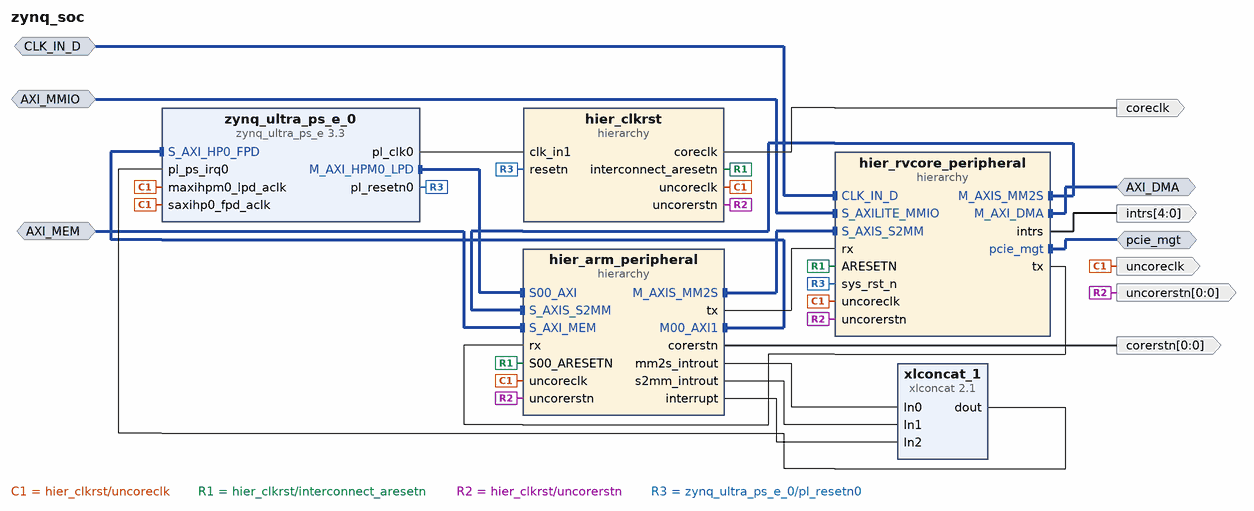
[diagram p0: block diagram of the top level]
# Vivado block design zynq_soc, xczu19eg-ffvc1760-2-i, Vivado 2020.2
create_bd_design zynq_soc

create_bd_intf_port -mode Master -vlnv xilinx.com:interface:aximm_rtl:1.0 AXI_DMA
set_property -dict [list \
  CONFIG.ADDR_WIDTH 40 \
  CONFIG.DATA_WIDTH 64 \
  CONFIG.NUM_READ_OUTSTANDING 2 \
  CONFIG.NUM_WRITE_OUTSTANDING 2 \
  CONFIG.PROTOCOL AXI4 \
] [get_bd_intf_ports AXI_DMA]
create_bd_intf_port -mode Slave -vlnv xilinx.com:interface:aximm_rtl:1.0 AXI_MEM
set_property -dict [list \
  CONFIG.ADDR_WIDTH 40 \
  CONFIG.ARUSER_WIDTH 1 \
  CONFIG.AWUSER_WIDTH 1 \
  CONFIG.BUSER_WIDTH 0 \
  CONFIG.DATA_WIDTH 64 \
  CONFIG.HAS_BRESP 1 \
  CONFIG.HAS_BURST 1 \
  CONFIG.HAS_CACHE 1 \
  CONFIG.HAS_LOCK 1 \
  CONFIG.HAS_PROT 1 \
  CONFIG.HAS_QOS 1 \
  CONFIG.HAS_REGION 0 \
  CONFIG.HAS_RRESP 1 \
  CONFIG.HAS_WSTRB 1 \
  CONFIG.ID_WIDTH 4 \
  CONFIG.MAX_BURST_LENGTH 256 \
  CONFIG.NUM_READ_OUTSTANDING 16 \
  CONFIG.NUM_READ_THREADS 1 \
  CONFIG.NUM_WRITE_OUTSTANDING 16 \
  CONFIG.NUM_WRITE_THREADS 1 \
  CONFIG.PROTOCOL AXI4 \
  CONFIG.READ_WRITE_MODE READ_WRITE \
  CONFIG.RUSER_BITS_PER_BYTE 0 \
  CONFIG.RUSER_WIDTH 0 \
  CONFIG.SUPPORTS_NARROW_BURST 1 \
  CONFIG.WUSER_BITS_PER_BYTE 0 \
  CONFIG.WUSER_WIDTH 0 \
] [get_bd_intf_ports AXI_MEM]
create_bd_intf_port -mode Slave -vlnv xilinx.com:interface:aximm_rtl:1.0 AXI_MMIO
set_property -dict [list \
  CONFIG.ADDR_WIDTH 40 \
  CONFIG.ARUSER_WIDTH 0 \
  CONFIG.AWUSER_WIDTH 0 \
  CONFIG.BUSER_WIDTH 0 \
  CONFIG.DATA_WIDTH 64 \
  CONFIG.HAS_BRESP 1 \
  CONFIG.HAS_BURST 0 \
  CONFIG.HAS_CACHE 0 \
  CONFIG.HAS_LOCK 0 \
  CONFIG.HAS_PROT 1 \
  CONFIG.HAS_QOS 0 \
  CONFIG.HAS_REGION 0 \
  CONFIG.HAS_RRESP 1 \
  CONFIG.HAS_WSTRB 1 \
  CONFIG.ID_WIDTH 8 \
  CONFIG.MAX_BURST_LENGTH 1 \
  CONFIG.NUM_READ_OUTSTANDING 2 \
  CONFIG.NUM_READ_THREADS 1 \
  CONFIG.NUM_WRITE_OUTSTANDING 2 \
  CONFIG.NUM_WRITE_THREADS 1 \
  CONFIG.PROTOCOL AXI4 \
  CONFIG.READ_WRITE_MODE READ_WRITE \
  CONFIG.RUSER_BITS_PER_BYTE 0 \
  CONFIG.RUSER_WIDTH 0 \
  CONFIG.SUPPORTS_NARROW_BURST 0 \
  CONFIG.WUSER_BITS_PER_BYTE 0 \
  CONFIG.WUSER_WIDTH 0 \
] [get_bd_intf_ports AXI_MMIO]
create_bd_intf_port -mode Slave -vlnv xilinx.com:interface:diff_clock_rtl:1.0 CLK_IN_D
create_bd_intf_port -mode Master -vlnv xilinx.com:interface:pcie_7x_mgt_rtl:1.0 pcie_mgt
create_bd_port -dir O -type clk coreclk
create_bd_port -dir O -from 0 -to 0 corerstn
create_bd_port -dir O -from 4 -to 0 intrs
create_bd_port -dir O -type clk uncoreclk
set_property -dict {CONFIG.ASSOCIATED_BUSIF AXI_MEM:AXI_MMIO:AXI_DMA} [get_bd_ports uncoreclk]
create_bd_port -dir O -from 0 -to 0 -type rst uncorerstn

create_bd_cell -type hier hier_clkrst
create_bd_cell -type hier hier_rvcore_peripheral
create_bd_cell -type hier hier_arm_peripheral
create_bd_cell -type ip -vlnv xilinx.com:ip:xlconcat:2.1 xlconcat_1
set_property -dict {CONFIG.NUM_PORTS 3} [get_bd_cells xlconcat_1]
create_bd_cell -type ip -vlnv xilinx.com:ip:zynq_ultra_ps_e:3.3 zynq_ultra_ps_e_0
set_property -dict [list \
  CONFIG.CAN0_BOARD_INTERFACE custom \
  CONFIG.CAN1_BOARD_INTERFACE custom \
  CONFIG.CSU_BOARD_INTERFACE custom \
  CONFIG.DP_BOARD_INTERFACE custom \
  CONFIG.GEM0_BOARD_INTERFACE custom \
  CONFIG.GEM1_BOARD_INTERFACE custom \
  CONFIG.GEM2_BOARD_INTERFACE custom \
  CONFIG.GEM3_BOARD_INTERFACE custom \
  CONFIG.GPIO_BOARD_INTERFACE custom \
  CONFIG.IIC0_BOARD_INTERFACE custom \
  CONFIG.IIC1_BOARD_INTERFACE custom \
  CONFIG.NAND_BOARD_INTERFACE custom \
  CONFIG.PCIE_BOARD_INTERFACE custom \
  CONFIG.PJTAG_BOARD_INTERFACE custom \
  CONFIG.PMU_BOARD_INTERFACE custom \
  CONFIG.PSU_BANK_0_IO_STANDARD LVCMOS33 \
  CONFIG.PSU_BANK_1_IO_STANDARD LVCMOS33 \
  CONFIG.PSU_BANK_2_IO_STANDARD LVCMOS33 \
  CONFIG.PSU_BANK_3_IO_STANDARD LVCMOS33 \
  CONFIG.PSU_USB3__DUAL_CLOCK_ENABLE 1 \
  CONFIG.PSU__CAN1__PERIPHERAL__ENABLE 0 \
  CONFIG.PSU__CRF_APB__ACPU_CTRL__FREQMHZ 1200 \
  CONFIG.PSU__CRF_APB__ACPU_CTRL__SRCSEL APLL \
  CONFIG.PSU__CRF_APB__APLL_CTRL__SRCSEL PSS_REF_CLK \
  CONFIG.PSU__CRF_APB__DBG_FPD_CTRL__FREQMHZ 250 \
  CONFIG.PSU__CRF_APB__DBG_FPD_CTRL__SRCSEL IOPLL \
  CONFIG.PSU__CRF_APB__DBG_TRACE_CTRL__FREQMHZ 250 \
  CONFIG.PSU__CRF_APB__DBG_TRACE_CTRL__SRCSEL IOPLL \
  CONFIG.PSU__CRF_APB__DBG_TSTMP_CTRL__FREQMHZ 250 \
  CONFIG.PSU__CRF_APB__DBG_TSTMP_CTRL__SRCSEL IOPLL \
  CONFIG.PSU__CRF_APB__DDR_CTRL__FREQMHZ 1067 \
  CONFIG.PSU__CRF_APB__DDR_CTRL__SRCSEL DPLL \
  CONFIG.PSU__CRF_APB__DPDMA_REF_CTRL__FREQMHZ 600 \
  CONFIG.PSU__CRF_APB__DPDMA_REF_CTRL__SRCSEL APLL \
  CONFIG.PSU__CRF_APB__DPLL_CTRL__SRCSEL PSS_REF_CLK \
  CONFIG.PSU__CRF_APB__DP_AUDIO_REF_CTRL__SRCSEL RPLL \
  CONFIG.PSU__CRF_APB__DP_STC_REF_CTRL__SRCSEL RPLL \
  CONFIG.PSU__CRF_APB__DP_VIDEO_REF_CTRL__SRCSEL VPLL \
  CONFIG.PSU__CRF_APB__GDMA_REF_CTRL__FREQMHZ 600 \
  CONFIG.PSU__CRF_APB__GDMA_REF_CTRL__SRCSEL APLL \
  CONFIG.PSU__CRF_APB__GPU_REF_CTRL__FREQMHZ 500 \
  CONFIG.PSU__CRF_APB__GPU_REF_CTRL__SRCSEL IOPLL \
  CONFIG.PSU__CRF_APB__TOPSW_LSBUS_CTRL__FREQMHZ 100 \
  CONFIG.PSU__CRF_APB__TOPSW_LSBUS_CTRL__SRCSEL IOPLL \
  CONFIG.PSU__CRF_APB__TOPSW_MAIN_CTRL__FREQMHZ 533.33 \
  CONFIG.PSU__CRF_APB__TOPSW_MAIN_CTRL__SRCSEL DPLL \
  CONFIG.PSU__CRF_APB__VPLL_CTRL__SRCSEL PSS_REF_CLK \
  CONFIG.PSU__CRL_APB__ADMA_REF_CTRL__FREQMHZ 500 \
  CONFIG.PSU__CRL_APB__ADMA_REF_CTRL__SRCSEL IOPLL \
  CONFIG.PSU__CRL_APB__CAN1_REF_CTRL__FREQMHZ 100 \
  CONFIG.PSU__CRL_APB__CAN1_REF_CTRL__SRCSEL IOPLL \
  CONFIG.PSU__CRL_APB__CPU_R5_CTRL__FREQMHZ 500 \
  CONFIG.PSU__CRL_APB__CPU_R5_CTRL__SRCSEL IOPLL \
  CONFIG.PSU__CRL_APB__DBG_LPD_CTRL__FREQMHZ 250 \
  CONFIG.PSU__CRL_APB__DBG_LPD_CTRL__SRCSEL IOPLL \
  CONFIG.PSU__CRL_APB__GEM3_REF_CTRL__FREQMHZ 125 \
  CONFIG.PSU__CRL_APB__GEM3_REF_CTRL__SRCSEL IOPLL \
  CONFIG.PSU__CRL_APB__I2C0_REF_CTRL__FREQMHZ 100 \
  CONFIG.PSU__CRL_APB__I2C0_REF_CTRL__SRCSEL IOPLL \
  CONFIG.PSU__CRL_APB__I2C1_REF_CTRL__FREQMHZ 100 \
  CONFIG.PSU__CRL_APB__I2C1_REF_CTRL__SRCSEL IOPLL \
  CONFIG.PSU__CRL_APB__IOPLL_CTRL__SRCSEL PSS_REF_CLK \
  CONFIG.PSU__CRL_APB__IOU_SWITCH_CTRL__FREQMHZ 250 \
  CONFIG.PSU__CRL_APB__IOU_SWITCH_CTRL__SRCSEL IOPLL \
  CONFIG.PSU__CRL_APB__LPD_LSBUS_CTRL__FREQMHZ 100 \
  CONFIG.PSU__CRL_APB__LPD_LSBUS_CTRL__SRCSEL IOPLL \
  CONFIG.PSU__CRL_APB__LPD_SWITCH_CTRL__FREQMHZ 500 \
  CONFIG.PSU__CRL_APB__LPD_SWITCH_CTRL__SRCSEL IOPLL \
  CONFIG.PSU__CRL_APB__PCAP_CTRL__FREQMHZ 200 \
  CONFIG.PSU__CRL_APB__PCAP_CTRL__SRCSEL IOPLL \
  CONFIG.PSU__CRL_APB__PL0_REF_CTRL__FREQMHZ 100 \
  CONFIG.PSU__CRL_APB__PL0_REF_CTRL__SRCSEL IOPLL \
  CONFIG.PSU__CRL_APB__QSPI_REF_CTRL__FREQMHZ 125 \
  CONFIG.PSU__CRL_APB__QSPI_REF_CTRL__SRCSEL IOPLL \
  CONFIG.PSU__CRL_APB__RPLL_CTRL__SRCSEL PSS_REF_CLK \
  CONFIG.PSU__CRL_APB__SDIO1_REF_CTRL__FREQMHZ 200 \
  CONFIG.PSU__CRL_APB__SDIO1_REF_CTRL__SRCSEL IOPLL \
  CONFIG.PSU__CRL_APB__TIMESTAMP_REF_CTRL__FREQMHZ 100 \
  CONFIG.PSU__CRL_APB__TIMESTAMP_REF_CTRL__SRCSEL IOPLL \
  CONFIG.PSU__CRL_APB__UART0_REF_CTRL__FREQMHZ 100 \
  CONFIG.PSU__CRL_APB__UART0_REF_CTRL__SRCSEL IOPLL \
  CONFIG.PSU__CRL_APB__UART1_REF_CTRL__FREQMHZ 100 \
  CONFIG.PSU__CRL_APB__UART1_REF_CTRL__SRCSEL IOPLL \
  CONFIG.PSU__CRL_APB__USB0_BUS_REF_CTRL__FREQMHZ 250 \
  CONFIG.PSU__CRL_APB__USB0_BUS_REF_CTRL__SRCSEL IOPLL \
  CONFIG.PSU__CRL_APB__USB3_DUAL_REF_CTRL__FREQMHZ 20 \
  CONFIG.PSU__CRL_APB__USB3_DUAL_REF_CTRL__SRCSEL IOPLL \
  CONFIG.PSU__CRL_APB__USB3__ENABLE 1 \
  CONFIG.PSU__CSUPMU__PERIPHERAL__VALID 0 \
  CONFIG.PSU__DDRC__BUS_WIDTH {64 Bit} \
  CONFIG.PSU__DDRC__COMPONENTS UDIMM \
  CONFIG.PSU__DDRC__DEVICE_CAPACITY {4096 MBits} \
  CONFIG.PSU__DDRC__DRAM_WIDTH {8 Bits} \
  CONFIG.PSU__DDRC__ECC Disabled \
  CONFIG.PSU__DDRC__MEMORY_TYPE {DDR 4} \
  CONFIG.PSU__DDRC__SPEED_BIN DDR4_2133P \
  CONFIG.PSU__DDR_HIGH_ADDRESS_GUI_ENABLE 1 \
  CONFIG.PSU__DDR__INTERFACE__FREQMHZ 533.500 \
  CONFIG.PSU__DEVICE_TYPE EG \
  CONFIG.PSU__DISPLAYPORT__PERIPHERAL__ENABLE 0 \
  CONFIG.PSU__DLL__ISUSED 1 \
  CONFIG.PSU__ENET3__FIFO__ENABLE 0 \
  CONFIG.PSU__ENET3__GRP_MDIO__ENABLE 1 \
  CONFIG.PSU__ENET3__GRP_MDIO__IO {MIO 76 .. 77} \
  CONFIG.PSU__ENET3__PERIPHERAL__ENABLE 1 \
  CONFIG.PSU__ENET3__PERIPHERAL__IO {MIO 64 .. 75} \
  CONFIG.PSU__ENET3__PTP__ENABLE 0 \
  CONFIG.PSU__ENET3__TSU__ENABLE 0 \
  CONFIG.PSU__FPGA_PL0_ENABLE 1 \
  CONFIG.PSU__GEM3_COHERENCY 0 \
  CONFIG.PSU__GEM3_ROUTE_THROUGH_FPD 0 \
  CONFIG.PSU__GEM__TSU__ENABLE 0 \
  CONFIG.PSU__GPIO0_MIO__PERIPHERAL__ENABLE 0 \
  CONFIG.PSU__GPIO1_MIO__PERIPHERAL__ENABLE 0 \
  CONFIG.PSU__I2C0__PERIPHERAL__ENABLE 1 \
  CONFIG.PSU__I2C0__PERIPHERAL__IO {MIO 14 .. 15} \
  CONFIG.PSU__I2C1__PERIPHERAL__ENABLE 1 \
  CONFIG.PSU__I2C1__PERIPHERAL__IO {MIO 16 .. 17} \
  CONFIG.PSU__IOU_SLCR__IOU_TTC_APB_CLK__TTC0_SEL APB \
  CONFIG.PSU__IOU_SLCR__IOU_TTC_APB_CLK__TTC1_SEL APB \
  CONFIG.PSU__IOU_SLCR__IOU_TTC_APB_CLK__TTC2_SEL APB \
  CONFIG.PSU__IOU_SLCR__IOU_TTC_APB_CLK__TTC3_SEL APB \
  CONFIG.PSU__LPD_SLCR__CSUPMU__FREQMHZ 100 \
  CONFIG.PSU__OVERRIDE__BASIC_CLOCK 0 \
  CONFIG.PSU__PCIE__CLASS_CODE_BASE 0x05 \
  CONFIG.PSU__PCIE__CLASS_CODE_INTERFACE 0x0 \
  CONFIG.PSU__PCIE__CLASS_CODE_SUB 0x80 \
  CONFIG.PSU__PCIE__DEVICE_ID 0xD011 \
  CONFIG.PSU__PCIE__INTX_GENERATION 1 \
  CONFIG.PSU__PCIE__REVISION_ID 0x0 \
  CONFIG.PSU__PCIE__SUBSYSTEM_ID 0x7 \
  CONFIG.PSU__PCIE__SUBSYSTEM_VENDOR_ID 0x10EE \
  CONFIG.PSU__PCIE__VENDOR_ID 0x10EE \
  CONFIG.PSU__PMU__GPO2__POLARITY low \
  CONFIG.PSU__PMU__GPO3__POLARITY low \
  CONFIG.PSU__PMU__GPO4__POLARITY low \
  CONFIG.PSU__PMU__GPO5__POLARITY low \
  CONFIG.PSU__PMU__PERIPHERAL__ENABLE 0 \
  CONFIG.PSU__PRESET_APPLIED 1 \
  CONFIG.PSU__PSS_REF_CLK__FREQMHZ 33.330 \
  CONFIG.PSU__QSPI__PERIPHERAL__ENABLE 0 \
  CONFIG.PSU__SATA__PERIPHERAL__ENABLE 0 \
  CONFIG.PSU__SAXIGP2__DATA_WIDTH 64 \
  CONFIG.PSU__SD1_COHERENCY 0 \
  CONFIG.PSU__SD1_ROUTE_THROUGH_FPD 0 \
  CONFIG.PSU__SD1__DATA_TRANSFER_MODE 4Bit \
  CONFIG.PSU__SD1__GRP_CD__ENABLE 1 \
  CONFIG.PSU__SD1__GRP_CD__IO {MIO 45} \
  CONFIG.PSU__SD1__GRP_POW__ENABLE 0 \
  CONFIG.PSU__SD1__GRP_WP__ENABLE 1 \
  CONFIG.PSU__SD1__GRP_WP__IO {MIO 44} \
  CONFIG.PSU__SD1__PERIPHERAL__ENABLE 1 \
  CONFIG.PSU__SD1__PERIPHERAL__IO {MIO 46 .. 51} \
  CONFIG.PSU__SD1__SLOT_TYPE {SD 2.0} \
  CONFIG.PSU__SWDT0__CLOCK__ENABLE 0 \
  CONFIG.PSU__SWDT0__PERIPHERAL__ENABLE 1 \
  CONFIG.PSU__SWDT0__RESET__ENABLE 0 \
  CONFIG.PSU__SWDT1__CLOCK__ENABLE 0 \
  CONFIG.PSU__SWDT1__PERIPHERAL__ENABLE 1 \
  CONFIG.PSU__SWDT1__RESET__ENABLE 0 \
  CONFIG.PSU__TSU__BUFG_PORT_PAIR 0 \
  CONFIG.PSU__TTC0__CLOCK__ENABLE 0 \
  CONFIG.PSU__TTC0__PERIPHERAL__ENABLE 1 \
  CONFIG.PSU__TTC0__WAVEOUT__ENABLE 0 \
  CONFIG.PSU__TTC1__CLOCK__ENABLE 0 \
  CONFIG.PSU__TTC1__PERIPHERAL__ENABLE 1 \
  CONFIG.PSU__TTC1__WAVEOUT__ENABLE 0 \
  CONFIG.PSU__TTC2__CLOCK__ENABLE 0 \
  CONFIG.PSU__TTC2__PERIPHERAL__ENABLE 1 \
  CONFIG.PSU__TTC2__WAVEOUT__ENABLE 0 \
  CONFIG.PSU__TTC3__CLOCK__ENABLE 0 \
  CONFIG.PSU__TTC3__PERIPHERAL__ENABLE 1 \
  CONFIG.PSU__TTC3__WAVEOUT__ENABLE 0 \
  CONFIG.PSU__UART0__BAUD_RATE 115200 \
  CONFIG.PSU__UART0__MODEM__ENABLE 0 \
  CONFIG.PSU__UART0__PERIPHERAL__ENABLE 1 \
  CONFIG.PSU__UART0__PERIPHERAL__IO {MIO 18 .. 19} \
  CONFIG.PSU__UART1__PERIPHERAL__ENABLE 0 \
  CONFIG.PSU__USB0_COHERENCY 0 \
  CONFIG.PSU__USB0__PERIPHERAL__ENABLE 1 \
  CONFIG.PSU__USB0__PERIPHERAL__IO {MIO 52 .. 63} \
  CONFIG.PSU__USB0__REF_CLK_FREQ 100 \
  CONFIG.PSU__USB0__REF_CLK_SEL {Ref Clk0} \
  CONFIG.PSU__USB2_0__EMIO__ENABLE 0 \
  CONFIG.PSU__USB3_0__EMIO__ENABLE 0 \
  CONFIG.PSU__USB3_0__PERIPHERAL__ENABLE 1 \
  CONFIG.PSU__USB3_0__PERIPHERAL__IO {GT Lane2} \
  CONFIG.PSU__USB__RESET__MODE {Boot Pin} \
  CONFIG.PSU__USB__RESET__POLARITY {Active Low} \
  CONFIG.PSU__USE__IRQ0 1 \
  CONFIG.PSU__USE__M_AXI_GP0 0 \
  CONFIG.PSU__USE__M_AXI_GP1 0 \
  CONFIG.PSU__USE__M_AXI_GP2 1 \
  CONFIG.PSU__USE__S_AXI_GP2 1 \
  CONFIG.QSPI_BOARD_INTERFACE custom \
  CONFIG.SATA_BOARD_INTERFACE custom \
  CONFIG.SD0_BOARD_INTERFACE custom \
  CONFIG.SD1_BOARD_INTERFACE custom \
  CONFIG.SPI0_BOARD_INTERFACE custom \
  CONFIG.SPI1_BOARD_INTERFACE custom \
  CONFIG.SUBPRESET1 Custom \
  CONFIG.SUBPRESET2 Custom \
  CONFIG.SWDT0_BOARD_INTERFACE custom \
  CONFIG.SWDT1_BOARD_INTERFACE custom \
  CONFIG.TRACE_BOARD_INTERFACE custom \
  CONFIG.TTC0_BOARD_INTERFACE custom \
  CONFIG.TTC1_BOARD_INTERFACE custom \
  CONFIG.TTC2_BOARD_INTERFACE custom \
  CONFIG.TTC3_BOARD_INTERFACE custom \
  CONFIG.UART0_BOARD_INTERFACE custom \
  CONFIG.UART1_BOARD_INTERFACE custom \
  CONFIG.USB0_BOARD_INTERFACE custom \
  CONFIG.USB1_BOARD_INTERFACE custom \
] [get_bd_cells zynq_ultra_ps_e_0]
# 769 more settings of zynq_ultra_ps_e_0 are not shown: defaults, MIO pin electricals, DDR timing, and values the tool derives

# ---- hierarchy /hier_clkrst ----
current_bd_instance /hier_clkrst
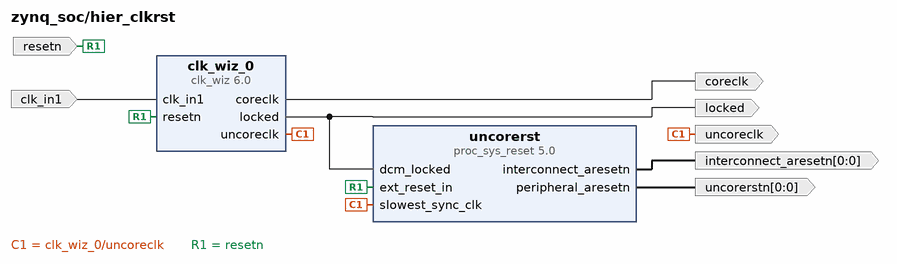
[diagram p1: block diagram inside /hier_clkrst]
create_bd_pin -dir I -type clk clk_in1
create_bd_pin -dir O -type clk coreclk
create_bd_pin -dir O -from 0 -to 0 -type rst interconnect_aresetn
create_bd_pin -dir O locked
create_bd_pin -dir I -type rst resetn
create_bd_pin -dir O -type clk uncoreclk
create_bd_pin -dir O -from 0 -to 0 -type rst uncorerstn

create_bd_cell -type ip -vlnv xilinx.com:ip:clk_wiz:6.0 clk_wiz_0
set_property -dict [list \
  CONFIG.CLKIN1_JITTER_PS 100.01 \
  CONFIG.CLKOUT1_JITTER 107.579 \
  CONFIG.CLKOUT1_PHASE_ERROR 87.187 \
  CONFIG.CLKOUT1_REQUESTED_OUT_FREQ 150.000 \
  CONFIG.CLKOUT2_JITTER 115.843 \
  CONFIG.CLKOUT2_PHASE_ERROR 87.187 \
  CONFIG.CLKOUT2_REQUESTED_OUT_FREQ 100.000 \
  CONFIG.CLKOUT2_USED true \
  CONFIG.CLKOUT3_JITTER 107.579 \
  CONFIG.CLKOUT3_PHASE_ERROR 87.187 \
  CONFIG.CLKOUT3_REQUESTED_OUT_FREQ 100.000 \
  CONFIG.CLKOUT3_USED false \
  CONFIG.CLK_OUT1_PORT coreclk \
  CONFIG.CLK_OUT2_PORT uncoreclk \
  CONFIG.MMCM_CLKFBOUT_MULT_F 12.000 \
  CONFIG.MMCM_CLKIN1_PERIOD 10.000 \
  CONFIG.MMCM_CLKIN2_PERIOD 10.000 \
  CONFIG.MMCM_CLKOUT0_DIVIDE_F 8.000 \
  CONFIG.MMCM_CLKOUT1_DIVIDE 12 \
  CONFIG.MMCM_CLKOUT2_DIVIDE 1 \
  CONFIG.MMCM_DIVCLK_DIVIDE 1 \
  CONFIG.NUM_OUT_CLKS 2 \
  CONFIG.RESET_PORT resetn \
  CONFIG.RESET_TYPE ACTIVE_LOW \
] [get_bd_cells clk_wiz_0]
create_bd_cell -type ip -vlnv xilinx.com:ip:proc_sys_reset:5.0 uncorerst

# ---- hierarchy /hier_rvcore_peripheral ----
current_bd_instance /hier_rvcore_peripheral
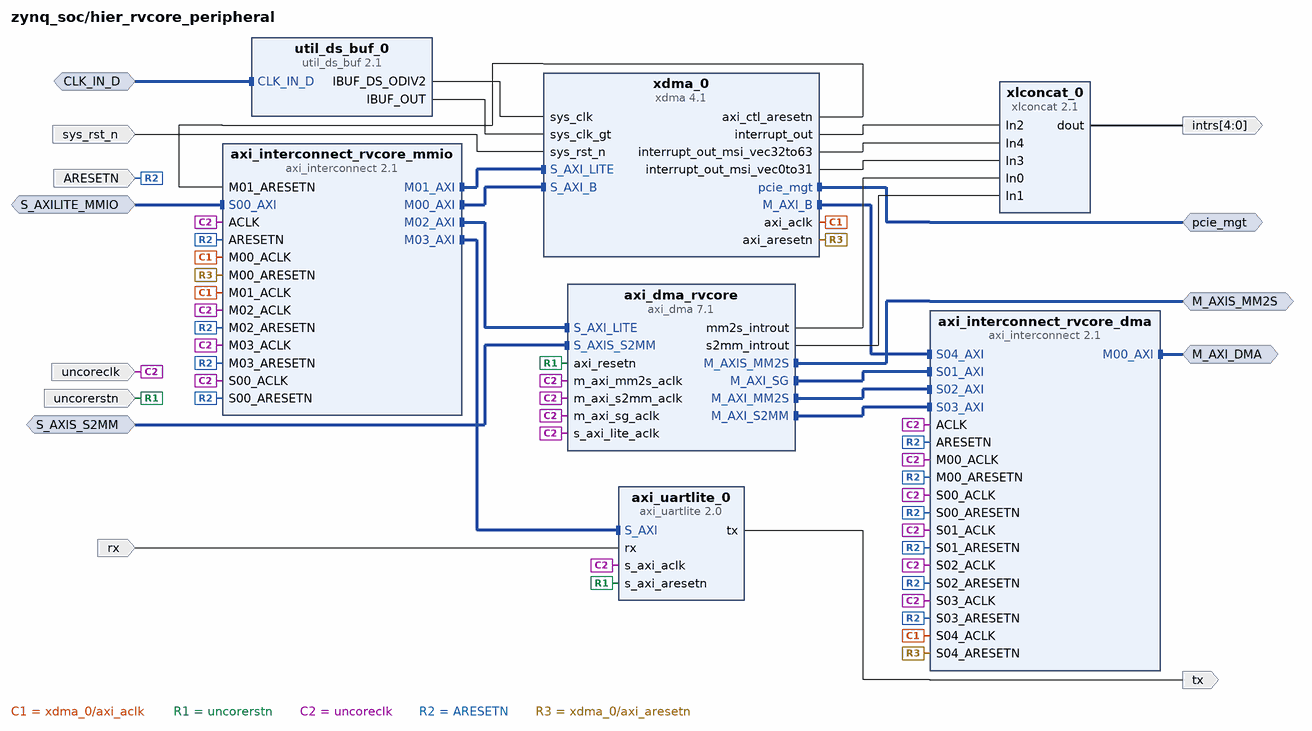
[diagram p2: block diagram inside /hier_rvcore_peripheral]
create_bd_intf_pin -mode Slave -vlnv xilinx.com:interface:diff_clock_rtl:1.0 CLK_IN_D
create_bd_intf_pin -mode Master -vlnv xilinx.com:interface:axis_rtl:1.0 M_AXIS_MM2S
create_bd_intf_pin -mode Master -vlnv xilinx.com:interface:aximm_rtl:1.0 M_AXI_DMA
create_bd_intf_pin -mode Slave -vlnv xilinx.com:interface:aximm_rtl:1.0 S_AXILITE_MMIO
create_bd_intf_pin -mode Slave -vlnv xilinx.com:interface:axis_rtl:1.0 S_AXIS_S2MM
create_bd_intf_pin -mode Master -vlnv xilinx.com:interface:pcie_7x_mgt_rtl:1.0 pcie_mgt
create_bd_pin -dir I -type rst ARESETN
create_bd_pin -dir O -from 4 -to 0 intrs
create_bd_pin -dir I rx
create_bd_pin -dir I -type rst sys_rst_n
create_bd_pin -dir O tx
create_bd_pin -dir I -type clk uncoreclk
create_bd_pin -dir I -type rst uncorerstn

create_bd_cell -type ip -vlnv xilinx.com:ip:axi_dma:7.1 axi_dma_rvcore
set_property -dict [list \
  CONFIG.c_addr_width 40 \
  CONFIG.c_include_mm2s_dre 1 \
  CONFIG.c_include_s2mm_dre 1 \
  CONFIG.c_sg_include_stscntrl_strm 0 \
  CONFIG.c_sg_length_width 16 \
] [get_bd_cells axi_dma_rvcore]
create_bd_cell -type ip -vlnv xilinx.com:ip:axi_interconnect:2.1 axi_interconnect_rvcore_dma
set_property -dict {CONFIG.NUM_MI 1 CONFIG.NUM_SI 5} [get_bd_cells axi_interconnect_rvcore_dma]
create_bd_cell -type ip -vlnv xilinx.com:ip:axi_interconnect:2.1 axi_interconnect_rvcore_mmio
set_property -dict {CONFIG.NUM_MI 4} [get_bd_cells axi_interconnect_rvcore_mmio]
create_bd_cell -type ip -vlnv xilinx.com:ip:axi_uartlite:2.0 axi_uartlite_0
set_property -dict {CONFIG.C_BAUDRATE 115200} [get_bd_cells axi_uartlite_0]
create_bd_cell -type ip -vlnv xilinx.com:ip:util_ds_buf:2.1 util_ds_buf_0
set_property -dict {CONFIG.C_BUF_TYPE IBUFDSGTE} [get_bd_cells util_ds_buf_0]
create_bd_cell -type ip -vlnv xilinx.com:ip:xdma:4.1 xdma_0
set_property -dict [list \
  CONFIG.BASEADDR 0x00000000 \
  CONFIG.HIGHADDR 0x001FFFFF \
  CONFIG.PF0_DEVICE_ID_mqdma 9131 \
  CONFIG.PF2_DEVICE_ID_mqdma 9131 \
  CONFIG.PF3_DEVICE_ID_mqdma 9131 \
  CONFIG.axi_addr_width 40 \
  CONFIG.axibar2pciebar_0 0x0000000050000000 \
  CONFIG.axisten_freq 125 \
  CONFIG.device_port_type Root_Port_of_PCI_Express_Root_Complex \
  CONFIG.dma_reset_source_sel Phy_Ready \
  CONFIG.en_gt_selection true \
  CONFIG.functional_mode AXI_Bridge \
  CONFIG.mode_selection Advanced \
  CONFIG.msi_rx_pin_en TRUE \
  CONFIG.pciebar2axibar_0 0x0000000080000000 \
  CONFIG.pf0_bar0_64bit true \
  CONFIG.pf0_bar0_scale Megabytes \
  CONFIG.pf0_bar0_size 64 \
  CONFIG.pf0_bar0_type_mqdma Memory \
  CONFIG.pf0_base_class_menu Bridge_device \
  CONFIG.pf0_base_class_menu_mqdma Bridge_device \
  CONFIG.pf0_class_code_base_mqdma 06 \
  CONFIG.pf0_class_code_interface 00 \
  CONFIG.pf0_class_code_sub 04 \
  CONFIG.pf0_device_id 9131 \
  CONFIG.pf0_sriov_bar0_type Memory \
  CONFIG.pf0_sub_class_interface_menu CardBus_bridge \
  CONFIG.pf1_base_class_menu Bridge_device \
  CONFIG.pf1_base_class_menu_mqdma Bridge_device \
  CONFIG.pf1_class_code_base_mqdma 06 \
  CONFIG.pf1_class_code_interface 00 \
  CONFIG.pf1_class_code_sub 07 \
  CONFIG.pf1_sub_class_interface_menu CardBus_bridge \
  CONFIG.pf2_base_class_menu_mqdma Bridge_device \
  CONFIG.pf2_class_code_base_mqdma 06 \
  CONFIG.pf3_base_class_menu_mqdma Bridge_device \
  CONFIG.pf3_class_code_base_mqdma 06 \
  CONFIG.pl_link_cap_max_link_speed 8.0_GT/s \
  CONFIG.plltype QPLL1 \
  CONFIG.select_quad GTY_Quad_128 \
  CONFIG.type1_membase_memlimit_enable Enabled \
  CONFIG.type1_prefetchable_membase_memlimit 64bit_Enabled \
] [get_bd_cells xdma_0]
create_bd_cell -type ip -vlnv xilinx.com:ip:xlconcat:2.1 xlconcat_0
set_property -dict {CONFIG.NUM_PORTS 5} [get_bd_cells xlconcat_0]

# ---- hierarchy /hier_arm_peripheral ----
current_bd_instance /hier_arm_peripheral
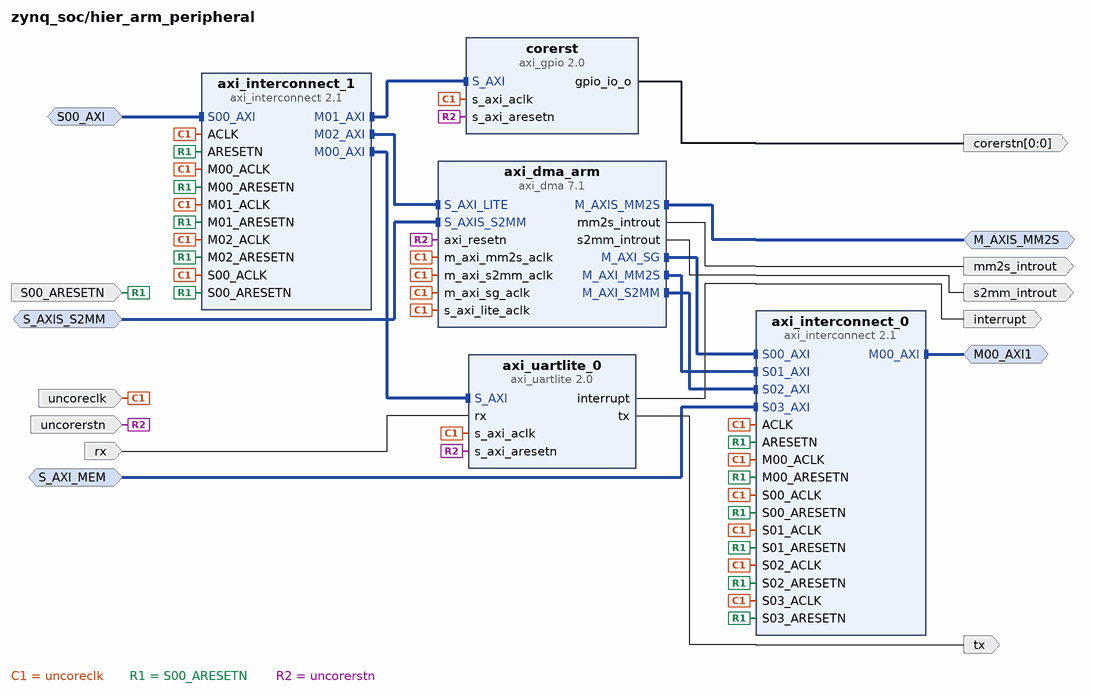
[diagram p3: block diagram inside /hier_arm_peripheral]
create_bd_intf_pin -mode Master -vlnv xilinx.com:interface:aximm_rtl:1.0 M00_AXI1
create_bd_intf_pin -mode Master -vlnv xilinx.com:interface:axis_rtl:1.0 M_AXIS_MM2S
create_bd_intf_pin -mode Slave -vlnv xilinx.com:interface:aximm_rtl:1.0 S00_AXI
create_bd_intf_pin -mode Slave -vlnv xilinx.com:interface:axis_rtl:1.0 S_AXIS_S2MM
create_bd_intf_pin -mode Slave -vlnv xilinx.com:interface:aximm_rtl:1.0 S_AXI_MEM
create_bd_pin -dir I -type rst S00_ARESETN
create_bd_pin -dir O -from 0 -to 0 corerstn
create_bd_pin -dir O -type intr interrupt
create_bd_pin -dir O -type intr mm2s_introut
create_bd_pin -dir I rx
create_bd_pin -dir O -type intr s2mm_introut
create_bd_pin -dir O tx
create_bd_pin -dir I -type clk uncoreclk
create_bd_pin -dir I -type rst uncorerstn

create_bd_cell -type ip -vlnv xilinx.com:ip:axi_dma:7.1 axi_dma_arm
set_property -dict [list \
  CONFIG.c_include_mm2s_dre 1 \
  CONFIG.c_include_s2mm_dre 1 \
  CONFIG.c_sg_include_stscntrl_strm 0 \
  CONFIG.c_sg_length_width 16 \
] [get_bd_cells axi_dma_arm]
create_bd_cell -type ip -vlnv xilinx.com:ip:axi_interconnect:2.1 axi_interconnect_0
set_property -dict {CONFIG.NUM_MI 1 CONFIG.NUM_SI 4} [get_bd_cells axi_interconnect_0]
create_bd_cell -type ip -vlnv xilinx.com:ip:axi_interconnect:2.1 axi_interconnect_1
set_property -dict {CONFIG.NUM_MI 3} [get_bd_cells axi_interconnect_1]
create_bd_cell -type ip -vlnv xilinx.com:ip:axi_uartlite:2.0 axi_uartlite_0
set_property -dict {CONFIG.C_BAUDRATE 115200} [get_bd_cells axi_uartlite_0]
create_bd_cell -type ip -vlnv xilinx.com:ip:axi_gpio:2.0 corerst
set_property -dict {CONFIG.C_ALL_OUTPUTS 1 CONFIG.C_GPIO_WIDTH 1 CONFIG.GPIO_BOARD_INTERFACE Custom} [get_bd_cells corerst]

# ---- connections ----

current_bd_instance /hier_clkrst
connect_bd_net -net clk_wiz_0_clk_out1 [get_bd_pins clk_wiz_0/uncoreclk] [get_bd_pins uncoreclk] [get_bd_pins uncorerst/slowest_sync_clk]
connect_bd_net [get_bd_pins clk_wiz_0/coreclk] [get_bd_pins coreclk]
connect_bd_net [get_bd_pins clk_wiz_0/locked] [get_bd_pins locked] [get_bd_pins uncorerst/dcm_locked]
connect_bd_net -net rvcore_uncorerst_interconnect_aresetn [get_bd_pins uncorerst/interconnect_aresetn] [get_bd_pins interconnect_aresetn]
connect_bd_net -net proc_sys_reset_1_peripheral_aresetn [get_bd_pins uncorerst/peripheral_aresetn] [get_bd_pins uncorerstn]
connect_bd_net -net zynq_ultra_ps_e_0_pl_clk1 [get_bd_pins clk_in1] [get_bd_pins clk_wiz_0/clk_in1]
connect_bd_net -net zynq_ultra_ps_e_0_pl_resetn0 [get_bd_pins resetn] [get_bd_pins clk_wiz_0/resetn] [get_bd_pins uncorerst/ext_reset_in]

current_bd_instance /hier_rvcore_peripheral
connect_bd_intf_net [get_bd_intf_pins CLK_IN_D] [get_bd_intf_pins util_ds_buf_0/CLK_IN_D]
connect_bd_intf_net [get_bd_intf_pins S_AXIS_S2MM] [get_bd_intf_pins axi_dma_rvcore/S_AXIS_S2MM]
connect_bd_intf_net [get_bd_intf_pins M_AXIS_MM2S] [get_bd_intf_pins axi_dma_rvcore/M_AXIS_MM2S]
connect_bd_intf_net [get_bd_intf_pins axi_dma_rvcore/M_AXI_SG] [get_bd_intf_pins axi_interconnect_rvcore_dma/S01_AXI]
connect_bd_intf_net [get_bd_intf_pins axi_dma_rvcore/M_AXI_MM2S] [get_bd_intf_pins axi_interconnect_rvcore_dma/S02_AXI]
connect_bd_intf_net [get_bd_intf_pins axi_dma_rvcore/M_AXI_S2MM] [get_bd_intf_pins axi_interconnect_rvcore_dma/S03_AXI]
connect_bd_intf_net [get_bd_intf_pins axi_interconnect_rvcore_dma/S04_AXI] [get_bd_intf_pins xdma_0/M_AXI_B]
connect_bd_intf_net [get_bd_intf_pins S_AXILITE_MMIO] [get_bd_intf_pins axi_interconnect_rvcore_mmio/S00_AXI]
connect_bd_intf_net -intf_net axi_interconnect_1_M00_AXI [get_bd_intf_pins M_AXI_DMA] [get_bd_intf_pins axi_interconnect_rvcore_dma/M00_AXI]
connect_bd_intf_net [get_bd_intf_pins axi_interconnect_rvcore_mmio/M01_AXI] [get_bd_intf_pins xdma_0/S_AXI_LITE]
connect_bd_intf_net [get_bd_intf_pins axi_dma_rvcore/S_AXI_LITE] [get_bd_intf_pins axi_interconnect_rvcore_mmio/M02_AXI]
connect_bd_intf_net [get_bd_intf_pins axi_interconnect_rvcore_mmio/M03_AXI] [get_bd_intf_pins axi_uartlite_0/S_AXI]
connect_bd_intf_net -intf_net axi_protocol_convert_0_M_AXI [get_bd_intf_pins axi_interconnect_rvcore_mmio/M00_AXI] [get_bd_intf_pins xdma_0/S_AXI_B]
connect_bd_intf_net [get_bd_intf_pins pcie_mgt] [get_bd_intf_pins xdma_0/pcie_mgt]
connect_bd_net -net M00_ACLK_1 [get_bd_pins xdma_0/axi_aclk] \
  [get_bd_pins axi_interconnect_rvcore_dma/S04_ACLK] [get_bd_pins axi_interconnect_rvcore_mmio/M00_ACLK] \
  [get_bd_pins axi_interconnect_rvcore_mmio/M01_ACLK]
connect_bd_net -net M01_ARESETN_1 [get_bd_pins xdma_0/axi_ctl_aresetn] [get_bd_pins axi_interconnect_rvcore_mmio/M01_ARESETN]
connect_bd_net [get_bd_pins axi_dma_rvcore/mm2s_introut] [get_bd_pins xlconcat_0/In0]
connect_bd_net [get_bd_pins axi_dma_rvcore/s2mm_introut] [get_bd_pins xlconcat_0/In1]
connect_bd_net -net axi_resetn_1 [get_bd_pins uncorerstn] [get_bd_pins axi_dma_rvcore/axi_resetn] [get_bd_pins axi_uartlite_0/s_axi_aresetn]
connect_bd_net [get_bd_pins axi_uartlite_0/tx] [get_bd_pins tx]
connect_bd_net -net clk_wiz_0_clk_out1 [get_bd_pins uncoreclk] \
  [get_bd_pins axi_dma_rvcore/m_axi_mm2s_aclk] [get_bd_pins axi_dma_rvcore/m_axi_s2mm_aclk] \
  [get_bd_pins axi_dma_rvcore/m_axi_sg_aclk] [get_bd_pins axi_dma_rvcore/s_axi_lite_aclk] \
  [get_bd_pins axi_interconnect_rvcore_dma/ACLK] [get_bd_pins axi_interconnect_rvcore_dma/M00_ACLK] \
  [get_bd_pins axi_interconnect_rvcore_dma/S00_ACLK] [get_bd_pins axi_interconnect_rvcore_dma/S01_ACLK] \
  [get_bd_pins axi_interconnect_rvcore_dma/S02_ACLK] [get_bd_pins axi_interconnect_rvcore_dma/S03_ACLK] \
  [get_bd_pins axi_interconnect_rvcore_mmio/ACLK] [get_bd_pins axi_interconnect_rvcore_mmio/M02_ACLK] \
  [get_bd_pins axi_interconnect_rvcore_mmio/M03_ACLK] [get_bd_pins axi_interconnect_rvcore_mmio/S00_ACLK] \
  [get_bd_pins axi_uartlite_0/s_axi_aclk]
connect_bd_net -net rvcore_uncorerst_interconnect_aresetn [get_bd_pins ARESETN] \
  [get_bd_pins axi_interconnect_rvcore_dma/ARESETN] [get_bd_pins axi_interconnect_rvcore_dma/M00_ARESETN] \
  [get_bd_pins axi_interconnect_rvcore_dma/S00_ARESETN] [get_bd_pins axi_interconnect_rvcore_dma/S01_ARESETN] \
  [get_bd_pins axi_interconnect_rvcore_dma/S02_ARESETN] [get_bd_pins axi_interconnect_rvcore_dma/S03_ARESETN] \
  [get_bd_pins axi_interconnect_rvcore_mmio/ARESETN] [get_bd_pins axi_interconnect_rvcore_mmio/M02_ARESETN] \
  [get_bd_pins axi_interconnect_rvcore_mmio/M03_ARESETN] [get_bd_pins axi_interconnect_rvcore_mmio/S00_ARESETN]
connect_bd_net [get_bd_pins rx] [get_bd_pins axi_uartlite_0/rx]
connect_bd_net [get_bd_pins sys_rst_n] [get_bd_pins xdma_0/sys_rst_n]
connect_bd_net [get_bd_pins util_ds_buf_0/IBUF_DS_ODIV2] [get_bd_pins xdma_0/sys_clk]
connect_bd_net [get_bd_pins util_ds_buf_0/IBUF_OUT] [get_bd_pins xdma_0/sys_clk_gt]
connect_bd_net [get_bd_pins xdma_0/axi_aresetn] \
  [get_bd_pins axi_interconnect_rvcore_dma/S04_ARESETN] [get_bd_pins axi_interconnect_rvcore_mmio/M00_ARESETN]
connect_bd_net [get_bd_pins xdma_0/interrupt_out] [get_bd_pins xlconcat_0/In2]
connect_bd_net [get_bd_pins xdma_0/interrupt_out_msi_vec32to63] [get_bd_pins xlconcat_0/In4]
connect_bd_net [get_bd_pins xlconcat_0/dout] [get_bd_pins intrs]
connect_bd_net -net xlconstant_0_dout [get_bd_pins xdma_0/interrupt_out_msi_vec0to31] [get_bd_pins xlconcat_0/In3]

current_bd_instance /hier_arm_peripheral
connect_bd_intf_net [get_bd_intf_pins M00_AXI1] [get_bd_intf_pins axi_interconnect_0/M00_AXI]
connect_bd_intf_net [get_bd_intf_pins axi_dma_arm/M_AXI_SG] [get_bd_intf_pins axi_interconnect_0/S00_AXI]
connect_bd_intf_net [get_bd_intf_pins S00_AXI] [get_bd_intf_pins axi_interconnect_1/S00_AXI]
connect_bd_intf_net [get_bd_intf_pins axi_dma_arm/M_AXI_MM2S] [get_bd_intf_pins axi_interconnect_0/S01_AXI]
connect_bd_intf_net [get_bd_intf_pins axi_dma_arm/M_AXI_S2MM] [get_bd_intf_pins axi_interconnect_0/S02_AXI]
connect_bd_intf_net [get_bd_intf_pins S_AXIS_S2MM] [get_bd_intf_pins axi_dma_arm/S_AXIS_S2MM]
connect_bd_intf_net [get_bd_intf_pins S_AXI_MEM] [get_bd_intf_pins axi_interconnect_0/S03_AXI]
connect_bd_intf_net [get_bd_intf_pins M_AXIS_MM2S] [get_bd_intf_pins axi_dma_arm/M_AXIS_MM2S]
connect_bd_intf_net [get_bd_intf_pins axi_interconnect_1/M00_AXI] [get_bd_intf_pins axi_uartlite_0/S_AXI]
connect_bd_intf_net [get_bd_intf_pins axi_interconnect_1/M01_AXI] [get_bd_intf_pins corerst/S_AXI]
connect_bd_intf_net [get_bd_intf_pins axi_dma_arm/S_AXI_LITE] [get_bd_intf_pins axi_interconnect_1/M02_AXI]
connect_bd_net [get_bd_pins axi_dma_arm/mm2s_introut] [get_bd_pins mm2s_introut]
connect_bd_net [get_bd_pins axi_dma_arm/s2mm_introut] [get_bd_pins s2mm_introut]
connect_bd_net -net axi_gpio_0_gpio_io_o [get_bd_pins corerst/gpio_io_o] [get_bd_pins corerstn]
connect_bd_net [get_bd_pins axi_uartlite_0/interrupt] [get_bd_pins interrupt]
connect_bd_net [get_bd_pins axi_uartlite_0/tx] [get_bd_pins tx]
connect_bd_net -net clk_wiz_0_clk_out1 [get_bd_pins uncoreclk] \
  [get_bd_pins axi_dma_arm/m_axi_mm2s_aclk] [get_bd_pins axi_dma_arm/m_axi_s2mm_aclk] [get_bd_pins axi_dma_arm/m_axi_sg_aclk] \
  [get_bd_pins axi_dma_arm/s_axi_lite_aclk] [get_bd_pins axi_interconnect_0/ACLK] [get_bd_pins axi_interconnect_0/M00_ACLK] \
  [get_bd_pins axi_interconnect_0/S00_ACLK] [get_bd_pins axi_interconnect_0/S01_ACLK] \
  [get_bd_pins axi_interconnect_0/S02_ACLK] [get_bd_pins axi_interconnect_0/S03_ACLK] [get_bd_pins axi_interconnect_1/ACLK] \
  [get_bd_pins axi_interconnect_1/M00_ACLK] [get_bd_pins axi_interconnect_1/M01_ACLK] \
  [get_bd_pins axi_interconnect_1/M02_ACLK] [get_bd_pins axi_interconnect_1/S00_ACLK] [get_bd_pins axi_uartlite_0/s_axi_aclk] \
  [get_bd_pins corerst/s_axi_aclk]
connect_bd_net -net rvcore_uncorerst_interconnect_aresetn [get_bd_pins S00_ARESETN] \
  [get_bd_pins axi_interconnect_0/ARESETN] [get_bd_pins axi_interconnect_0/M00_ARESETN] \
  [get_bd_pins axi_interconnect_0/S00_ARESETN] [get_bd_pins axi_interconnect_0/S01_ARESETN] \
  [get_bd_pins axi_interconnect_0/S02_ARESETN] [get_bd_pins axi_interconnect_0/S03_ARESETN] \
  [get_bd_pins axi_interconnect_1/ARESETN] [get_bd_pins axi_interconnect_1/M00_ARESETN] \
  [get_bd_pins axi_interconnect_1/M01_ARESETN] [get_bd_pins axi_interconnect_1/M02_ARESETN] \
  [get_bd_pins axi_interconnect_1/S00_ARESETN]
connect_bd_net -net proc_sys_reset_1_peripheral_aresetn [get_bd_pins uncorerstn] \
  [get_bd_pins axi_dma_arm/axi_resetn] [get_bd_pins axi_uartlite_0/s_axi_aresetn] [get_bd_pins corerst/s_axi_aresetn]
connect_bd_net [get_bd_pins rx] [get_bd_pins axi_uartlite_0/rx]

current_bd_instance /
connect_bd_intf_net [get_bd_intf_ports CLK_IN_D] [get_bd_intf_pins hier_rvcore_peripheral/CLK_IN_D]
connect_bd_intf_net [get_bd_intf_ports AXI_MMIO] [get_bd_intf_pins hier_rvcore_peripheral/S_AXILITE_MMIO]
connect_bd_intf_net [get_bd_intf_pins hier_rvcore_peripheral/M_AXIS_MM2S] [get_bd_intf_pins hier_arm_peripheral/S_AXIS_S2MM]
connect_bd_intf_net [get_bd_intf_ports AXI_MEM] [get_bd_intf_pins hier_arm_peripheral/S_AXI_MEM]
connect_bd_intf_net -intf_net axi_interconnect_1_M00_AXI [get_bd_intf_ports AXI_DMA] [get_bd_intf_pins hier_rvcore_peripheral/M_AXI_DMA]
connect_bd_intf_net [get_bd_intf_pins hier_rvcore_peripheral/S_AXIS_S2MM] [get_bd_intf_pins hier_arm_peripheral/M_AXIS_MM2S]
connect_bd_intf_net [get_bd_intf_pins hier_arm_peripheral/M00_AXI1] [get_bd_intf_pins zynq_ultra_ps_e_0/S_AXI_HP0_FPD]
connect_bd_intf_net -intf_net xdma_0_pcie_mgt [get_bd_intf_ports pcie_mgt] [get_bd_intf_pins hier_rvcore_peripheral/pcie_mgt]
connect_bd_intf_net [get_bd_intf_pins hier_arm_peripheral/S00_AXI] [get_bd_intf_pins zynq_ultra_ps_e_0/M_AXI_HPM0_LPD]
connect_bd_net -net axi_gpio_0_gpio_io_o [get_bd_pins hier_arm_peripheral/corerstn] [get_bd_ports corerstn]
connect_bd_net -net clk_wiz_0_clk_out1 [get_bd_pins hier_clkrst/uncoreclk] \
  [get_bd_ports uncoreclk] [get_bd_pins hier_rvcore_peripheral/uncoreclk] [get_bd_pins hier_arm_peripheral/uncoreclk] \
  [get_bd_pins zynq_ultra_ps_e_0/maxihpm0_lpd_aclk] [get_bd_pins zynq_ultra_ps_e_0/saxihp0_fpd_aclk]
connect_bd_net [get_bd_pins hier_clkrst/coreclk] [get_bd_ports coreclk]
connect_bd_net -net hier_dma_mm2s_introut [get_bd_pins hier_arm_peripheral/mm2s_introut] [get_bd_pins xlconcat_1/In0]
connect_bd_net -net hier_dma_s2mm_introut [get_bd_pins hier_arm_peripheral/s2mm_introut] [get_bd_pins xlconcat_1/In1]
connect_bd_net -net hier_rvcore_peripheral_rvcore_intrs [get_bd_pins hier_rvcore_peripheral/intrs] [get_bd_ports intrs]
connect_bd_net [get_bd_pins hier_arm_peripheral/interrupt] [get_bd_pins xlconcat_1/In2]
connect_bd_net -net rvcore_uncorerst_interconnect_aresetn [get_bd_pins hier_clkrst/interconnect_aresetn] \
  [get_bd_pins hier_rvcore_peripheral/ARESETN] [get_bd_pins hier_arm_peripheral/S00_ARESETN]
connect_bd_net -net proc_sys_reset_1_peripheral_aresetn [get_bd_pins hier_clkrst/uncorerstn] \
  [get_bd_ports uncorerstn] [get_bd_pins hier_rvcore_peripheral/uncorerstn] [get_bd_pins hier_arm_peripheral/uncorerstn]
connect_bd_net -net rx_1 [get_bd_pins hier_arm_peripheral/tx] [get_bd_pins hier_rvcore_peripheral/rx]
connect_bd_net -net rx_2 [get_bd_pins hier_rvcore_peripheral/tx] [get_bd_pins hier_arm_peripheral/rx]
connect_bd_net [get_bd_pins xlconcat_1/dout] [get_bd_pins zynq_ultra_ps_e_0/pl_ps_irq0]
connect_bd_net [get_bd_pins zynq_ultra_ps_e_0/pl_clk0] [get_bd_pins hier_clkrst/clk_in1]
connect_bd_net [get_bd_pins zynq_ultra_ps_e_0/pl_resetn0] [get_bd_pins hier_clkrst/resetn] [get_bd_pins hier_rvcore_peripheral/sys_rst_n]

# ---- address map ----
assign_bd_address -offset 0x0800000000 -range 2G -target_address_space [get_bd_addr_spaces AXI_MEM] [get_bd_addr_segs zynq_ultra_ps_e_0/SAXIGP2/HP0_DDR_LOW]
assign_bd_address -offset 0x0040000000 -range 64K -target_address_space [get_bd_addr_spaces AXI_MMIO] [get_bd_addr_segs hier_rvcore_peripheral/axi_dma_rvcore/S_AXI_LITE/Reg]
assign_bd_address -offset 0x0040600000 -range 64K -target_address_space [get_bd_addr_spaces AXI_MMIO] [get_bd_addr_segs hier_rvcore_peripheral/axi_uartlite_0/S_AXI/Reg]
assign_bd_address -offset 0x0050000000 -range 256M -target_address_space [get_bd_addr_spaces AXI_MMIO] [get_bd_addr_segs hier_rvcore_peripheral/xdma_0/S_AXI_B/BAR0]
assign_bd_address -offset 0x0060000000 -range 512M -target_address_space [get_bd_addr_spaces AXI_MMIO] [get_bd_addr_segs hier_rvcore_peripheral/xdma_0/S_AXI_LITE/CTL0]
assign_bd_address -offset 0x00000000 -range 2G -target_address_space [get_bd_addr_spaces hier_arm_peripheral/axi_dma_arm/Data_MM2S] [get_bd_addr_segs zynq_ultra_ps_e_0/SAXIGP2/HP0_DDR_LOW]
assign_bd_address -offset 0x00000000 -range 2G -target_address_space [get_bd_addr_spaces hier_arm_peripheral/axi_dma_arm/Data_S2MM] [get_bd_addr_segs zynq_ultra_ps_e_0/SAXIGP2/HP0_DDR_LOW]
assign_bd_address -offset 0x00000000 -range 2G -target_address_space [get_bd_addr_spaces hier_arm_peripheral/axi_dma_arm/Data_SG] [get_bd_addr_segs zynq_ultra_ps_e_0/SAXIGP2/HP0_DDR_LOW]
assign_bd_address -offset 0x0000000000 -range 1T -target_address_space [get_bd_addr_spaces hier_rvcore_peripheral/axi_dma_rvcore/Data_MM2S] [get_bd_addr_segs AXI_DMA/Reg]
assign_bd_address -offset 0x0000000000 -range 1T -target_address_space [get_bd_addr_spaces hier_rvcore_peripheral/axi_dma_rvcore/Data_S2MM] [get_bd_addr_segs AXI_DMA/Reg]
assign_bd_address -offset 0x0000000000 -range 1T -target_address_space [get_bd_addr_spaces hier_rvcore_peripheral/axi_dma_rvcore/Data_SG] [get_bd_addr_segs AXI_DMA/Reg]
assign_bd_address -offset 0x0000000000 -range 1T -target_address_space [get_bd_addr_spaces hier_rvcore_peripheral/xdma_0/M_AXI_B] [get_bd_addr_segs AXI_DMA/Reg]
assign_bd_address -offset 0x0080000000 -range 4K -target_address_space [get_bd_addr_spaces zynq_ultra_ps_e_0/Data] [get_bd_addr_segs hier_arm_peripheral/axi_uartlite_0/S_AXI/Reg]
assign_bd_address -offset 0x0080010000 -range 4K -target_address_space [get_bd_addr_spaces zynq_ultra_ps_e_0/Data] [get_bd_addr_segs hier_arm_peripheral/corerst/S_AXI/Reg]
assign_bd_address -offset 0x0080020000 -range 4K -target_address_space [get_bd_addr_spaces zynq_ultra_ps_e_0/Data] [get_bd_addr_segs hier_arm_peripheral/axi_dma_arm/S_AXI_LITE/Reg]

validate_bd_design
save_bd_design
